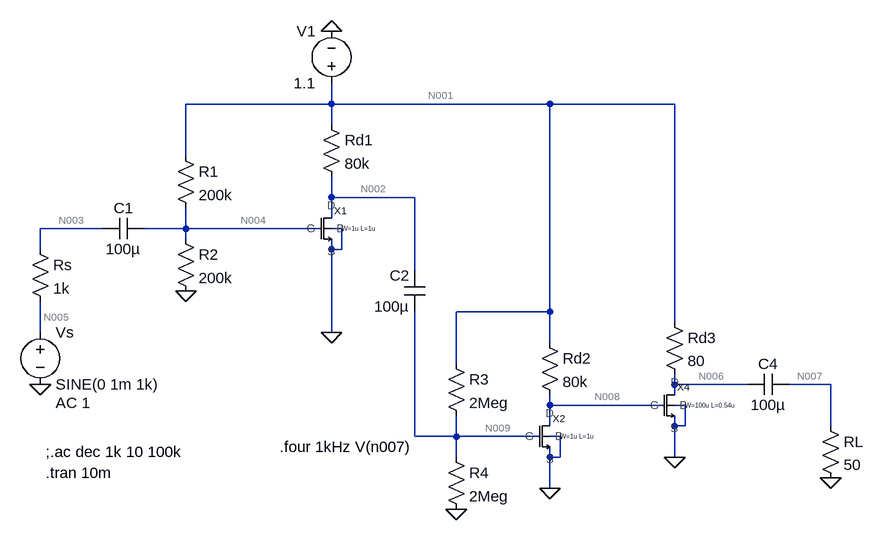
[diagram p0: schematic Mini-Project2.asc]
Mini-Project2.asc, the LTspice schematic file:
Version 4
SHEET 1 1812 772
WIRE -352 32 -352 0
WIRE -352 32 -576 32
WIRE -16 32 -352 32
WIRE 176 32 -16 32
WIRE -352 64 -352 32
WIRE -576 112 -576 32
WIRE -352 176 -352 144
WIRE -224 176 -352 176
WIRE -352 208 -352 176
WIRE -704 224 -800 224
WIRE -576 224 -576 192
WIRE -576 224 -640 224
WIRE -368 224 -576 224
WIRE -336 224 -352 224
WIRE -576 240 -576 224
WIRE -800 256 -800 224
WIRE -352 256 -352 240
WIRE -336 256 -336 224
WIRE -336 256 -352 256
WIRE -224 288 -224 176
WIRE -16 352 -16 32
WIRE -16 352 -160 352
WIRE 176 368 176 32
WIRE -800 384 -800 336
WIRE -352 384 -352 256
WIRE -16 400 -16 352
WIRE -160 432 -160 352
WIRE 176 464 176 448
WIRE 288 464 176 464
WIRE 416 464 352 464
WIRE 176 480 176 464
WIRE -16 496 -16 480
WIRE 160 496 -16 496
WIRE 192 496 176 496
WIRE -16 528 -16 496
WIRE 176 528 176 512
WIRE 192 528 192 496
WIRE 192 528 176 528
WIRE 416 528 416 464
WIRE -224 544 -224 352
WIRE -160 544 -160 512
WIRE -160 544 -224 544
WIRE -32 544 -160 544
WIRE 0 544 -16 544
WIRE -160 576 -160 544
WIRE -16 576 -16 560
WIRE 0 576 0 544
WIRE 0 576 -16 576
WIRE 176 576 176 528
WIRE -16 624 -16 576
FLAG -352 -80 0
FLAG -576 320 0
FLAG -800 464 0
FLAG -352 384 0
FLAG -16 624 0
FLAG -160 656 0
FLAG 176 576 0
FLAG 416 608 0
SYMBOL nmos65 -336 224 R0
WINDOW 39 0 0 Left 0
SYMATTR SpiceLine W=1u L=1u
SYMATTR InstName X1
SYMBOL voltage -352 16 R180
WINDOW 0 24 96 Left 2
WINDOW 3 24 16 Left 2
WINDOW 123 0 0 Left 0
WINDOW 39 0 0 Left 0
SYMATTR InstName V1
SYMATTR Value 1.1
SYMBOL res -592 96 R0
SYMATTR InstName R1
SYMATTR Value 200k
SYMBOL res -592 224 R0
SYMATTR InstName R2
SYMATTR Value 200k
SYMBOL cap -640 208 R90
WINDOW 0 0 32 VBottom 2
WINDOW 3 32 32 VTop 2
SYMATTR InstName C1
SYMATTR Value 100µ
SYMBOL res -816 240 R0
SYMATTR InstName Rs
SYMATTR Value 1k
SYMBOL voltage -800 368 R0
WINDOW 123 24 124 Left 2
WINDOW 39 0 0 Left 0
SYMATTR Value2 AC 1
SYMATTR InstName Vs
SYMATTR Value SINE(0 1m 1k)
SYMBOL res -368 48 R0
SYMATTR InstName Rd1
SYMATTR Value 80k
SYMBOL res -32 384 R0
SYMATTR InstName Rd2
SYMATTR Value 80k
SYMBOL nmos65 0 544 R0
WINDOW 39 0 0 Left 0
SYMATTR SpiceLine W=1u L=1u
SYMATTR InstName X2
SYMBOL cap -208 352 R180
WINDOW 0 24 56 Left 2
WINDOW 3 24 8 Left 2
SYMATTR InstName C2
SYMATTR Value 100µ
SYMBOL res -176 416 R0
SYMATTR InstName R3
SYMATTR Value 2Meg
SYMBOL res -176 560 R0
SYMATTR InstName R4
SYMATTR Value 2Meg
SYMBOL nmos65 192 496 R0
WINDOW 39 0 0 Left 0
SYMATTR SpiceLine W=100u L=0.54u
SYMATTR InstName X4
SYMBOL res 160 352 R0
SYMATTR InstName Rd3
SYMATTR Value 80
SYMBOL cap 352 448 R90
WINDOW 0 0 32 VBottom 2
WINDOW 3 32 32 VTop 2
SYMATTR InstName C4
SYMATTR Value 100µ
SYMBOL res 400 512 R0
SYMATTR InstName RL
SYMATTR Value 50
TEXT -792 568 Left 2 !;.ac dec 1k 10 100k
TEXT -792 600 Left 2 !.tran 10m
TEXT -432 560 Left 2 !.four 1kHz V(n007)

The netlist it stands for:
* Mini-Project2.asc
XX1 N004 N002 0 0 nmos65 params: W=1u L=1u  ; pins G D S B
V1 N001 0 1.1
R1 N001 N004 200k
R2 N004 0 200k
C1 N004 N003 100µ
Rs N003 N005 1k
Vs N005 0 SINE(0 1m 1k) AC 1
Rd1 N001 N002 80k
Rd2 N001 N008 80k
XX2 N009 N008 0 0 nmos65 params: W=1u L=1u  ; pins G D S B
C2 N009 N002 100µ
R3 N001 N009 2Meg
R4 N009 0 2Meg
XX4 N008 N006 0 0 nmos65 params: W=100u L=0.54u  ; pins G D S B
Rd3 N001 N006 80
C4 N007 N006 100µ
RL N007 0 50
;.ac dec 1k 10 100k
.tran 10m
.four 1kHz V(n007)
.backanno
.end

* Results of the author's LTspice run, read from the files saved beside the schematic
* Operating Point, zero values left out:
*   V(n002) = 619.5 mV
*   V(n004) = 549.5 mV
*   V(n001) = 1.1 V
*   V(n008) = 602.1 mV
*   V(n009) = 544.9 mV
*   V(n006) = 940.7 mV
*   I(Rd3) = 1.992 mA
*   I(R4) = 272.5 nA
*   I(R3) = 277.5 nA
*   I(Rd2) = 6.223 µA
*   I(Rd1) = 6.007 µA
*   I(R2) = 2.747 µA
*   I(R1) = 2.753 µA
*   I(V1) = -2.007 mA
*   Ix(x1:G) = 5.393 nA
*   Ix(x1:D) = 6.007 µA
*   Ix(x1:S) = -6.012 µA
*   Ix(x2:G) = 5.082 nA
*   Ix(x2:D) = 5.694 µA
*   Ix(x2:S) = -5.699 µA
*   Ix(x4:G) = 529.7 nA
*   Ix(x4:D) = 1.992 mA
*   Ix(x4:S) = -1.992 mA
*   Ix(x4:B) = -1.961 pA
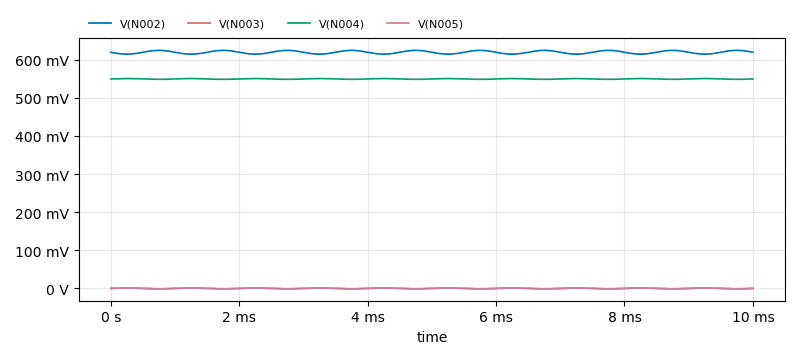
[diagram p1: Transient Analysis of Mini-Project2.asc, plotted from the saved traces]
* Transient Analysis, 1 run:
*   V(N002): min 614.5 mV, max 624.4 mV, average 619.5 mV, rms 619.5 mV, last 619.5 mV
*   V(N003): min -989.1 µV, max 989.1 µV, average -1.088 nV, rms 699.4 µV, last -8.229 nV
*   V(N004): min 548.5 mV, max 550.4 mV, average 549.5 mV, rms 549.5 mV, last 549.5 mV
*   V(N005): min -1 mV, max 1 mV, average -1.148 nV, rms 707.1 µV, last 0 V
* From the log:
*   N-Period=1
*   Fourier components of V(n007)
*   DC component:4.33096e-005
*   Harmonic  Frequency   Fourier   Normalized   Phase    Normalized
*    Number     [Hz]     Component   Component  [degree]  Phase [deg]
*       1     1.000e+03  1.004e-02  1.000e+00   -179.31°      0.00°
*       2     2.000e+03  3.373e-05  3.359e-03     89.74°    269.05°
*       3     3.000e+03  7.655e-06  7.623e-04   -178.77°      0.55°
*       4     4.000e+03  4.853e-07  4.832e-05    -29.91°    149.40°
*       5     5.000e+03  3.444e-07  3.429e-05     24.34°    203.66°
*       6     6.000e+03  1.975e-07  1.967e-05     57.49°    236.81°
*       7     7.000e+03  2.993e-08  2.981e-06    128.02°    307.33°
*       8     8.000e+03  1.366e-07  1.360e-05    -69.86°    109.46°
*       9     9.000e+03  2.371e-07  2.361e-05    -30.05°    149.27°
*   Total Harmonic Distortion: 0.344508%(0.349127%)